# Altium schematic sheet SensorManagementSystem.SchDoc: Sensor Management System
size A4; DocumentNumber: 1; SheetNumber: 2; SheetTotal: 2
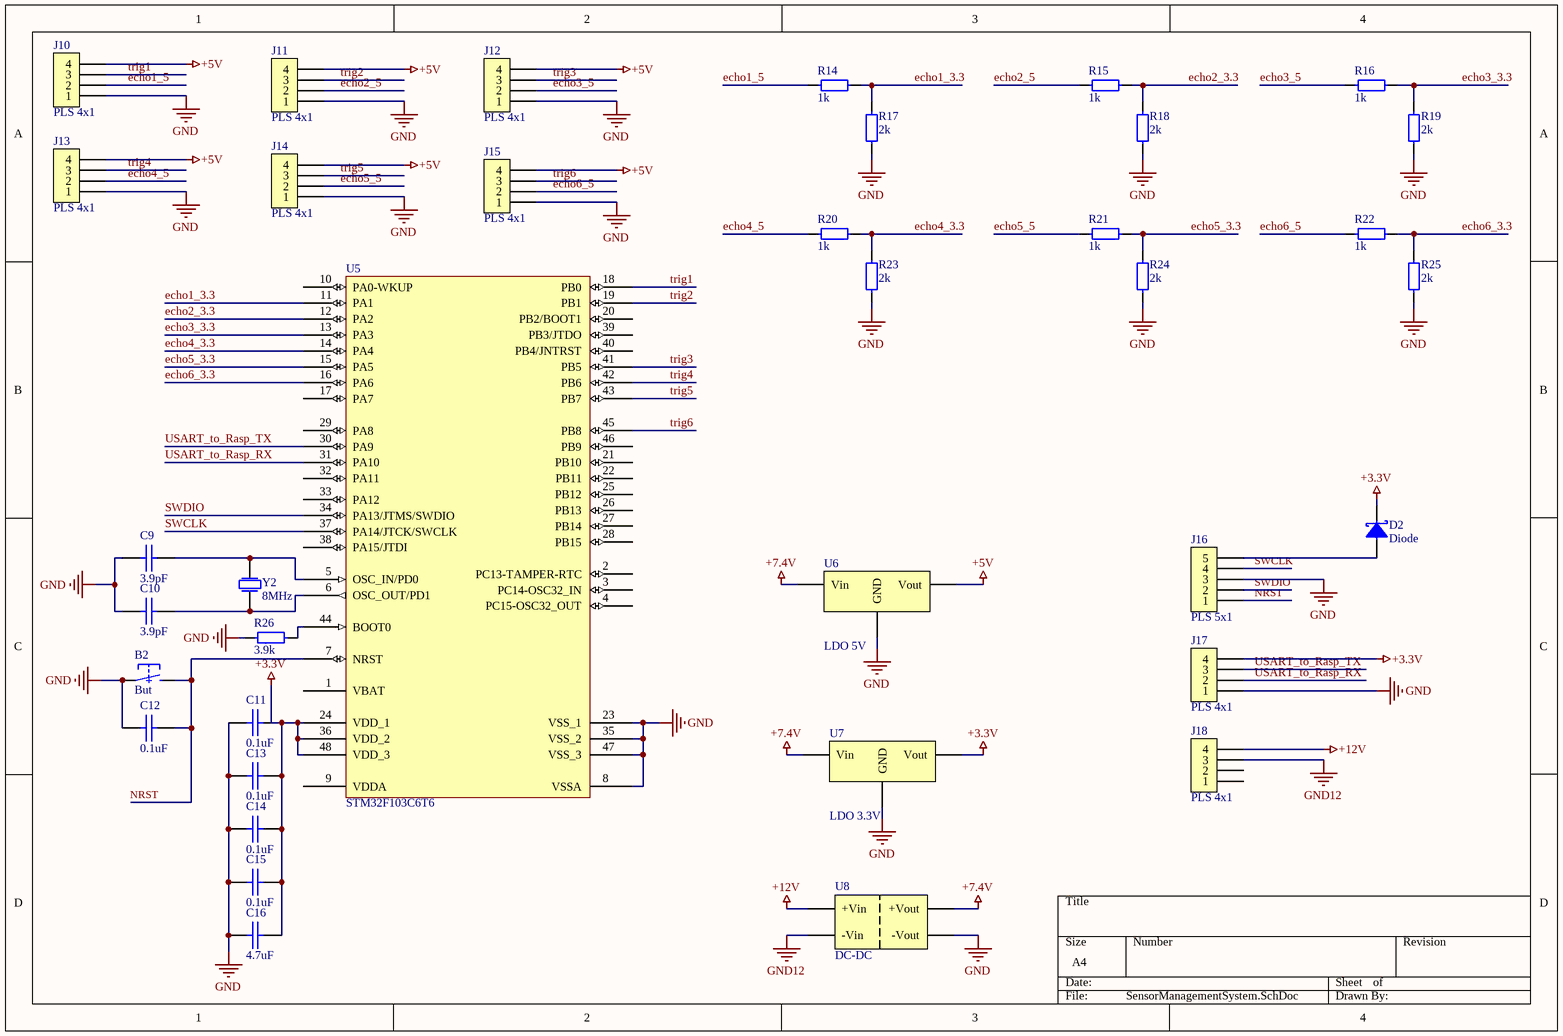
[diagram p0: SensorManagementSystem.SchDoc]

## Parts
B2  But  [BUTTON 6x3.5]
C9  3.9pF  [0805 Capicator]
C10  3.9pF  [0805 Capicator]
C11  0.1uF  [0805 Capicator]
C12  0.1uF  [0805 Capicator]
C13  0.1uF  [0805 Capicator]
C14  0.1uF  [0805 Capicator]
C15  0.1uF  [0805 Capicator]
C16  4.7uF  [0805 Capicator]
D2  Diode  [sod-123]
J10  PLS 4x1  [PLS 4x1]
J11  PLS 4x1  [PLS 4x1]
J12  PLS 4x1  [PLS 4x1]
J13  PLS 4x1  [PLS 4x1]
J14  PLS 4x1  [PLS 4x1]
J15  PLS 4x1  [PLS 4x1]
J16  PLS 5x1  [PLS 5x1]
J17  PLS 4x1  [PLS 4x1]
J18  PLS 4x1  [PLS 4x1]
R14  1k  [0805 Resistor]
R15  1k  [0805 Resistor]
R16  1k  [0805 Resistor]
R17  2k  [0805 Resistor]
R18  2k  [0805 Resistor]
R19  2k  [0805 Resistor]
R20  1k  [0805 Resistor]
R21  1k  [0805 Resistor]
R22  1k  [0805 Resistor]
R23  2k  [0805 Resistor]
R24  2k  [0805 Resistor]
R25  2k  [0805 Resistor]
R26  3.9k  [0805 Resistor]
U5  STM32F103C6T6  [STM32F103C6T6]
U6  LDO 5V  [TO-252]
U7  LDO 3.3V  [SOT-223]
U8  DC-DC  [DC-DC]
Y2  8MHz  [hc-49sm]

## Nets
+3.3V: C11.2 C13.2 C14.2 C15.2 C16.2 D2.2 J17.4 U5.24(VDD_1) U5.36(VDD_2) U5.48(VDD_3) U7.2(Vout)
+5V: J10.4 J11.4 J12.4 J13.4 J14.4 J15.4 U6.2(Vout)
+7.4V: U6.3(Vin) U7.3(Vin) U8.3(+Vout)
+12V: J18.4 U8.1(+Vin)
GND: B2.1 C9.1 C10.1 C11.1 C12.1 C13.1 C14.1 C15.1 C16.1 J10.1 J11.1 J12.1 J13.1 J14.1 J15.1 J16.3 J17.1 R17.1 R18.1 R19.1 R23.1 R24.1 R25.1 R26.1 U5.8(VSSA) U5.23(VSS_1) U5.35(VSS_2) U5.47(VSS_3) U6.1(GND) U7.1(GND) U8.4(-Vout)
GND12: J18.3 U8.2(-Vin)
echo1_3.3: R14.2 R17.2 U5.11(PA1)
echo1_5: J10.2 R14.1
echo2_3.3: R15.2 R18.2 U5.12(PA2)
echo2_5: J11.2 R15.1
echo3_3.3: R16.2 R19.2 U5.13(PA3)
echo3_5: J12.2 R16.1
echo4_3.3: R20.2 R23.2 U5.14(PA4)
echo4_5: J13.2 R20.1
echo5_3.3: R21.2 R24.2 U5.15(PA5)
echo5_5: J14.2 R21.1
echo6_3.3: R22.2 R25.2 U5.16(PA6)
echo6_5: J15.2 R22.1
NRST: B2.2 C12.2 J16.1 U5.7(NRST)
SWCLK: J16.4 U5.37(PA14/JTCK/SWCLK)
SWDIO: J16.2 U5.34(PA13/JTMS/SWDIO)
trig1: J10.3 U5.18(PB0)
trig2: J11.3 U5.19(PB1)
trig3: J12.3 U5.41(PB5)
trig4: J13.3 U5.42(PB6)
trig5: J14.3 U5.43(PB7)
trig6: J15.3 U5.45(PB8)
USART_to_Rasp_RX: J17.2 U5.31(PA10)
USART_to_Rasp_TX: J17.3 U5.30(PA9)
NetC9_2: C9.2 U5.5(OSC_IN/PD0) Y2.2
NetC10_2: C10.2 U5.6(OSC_OUT/PD1) Y2.1
NetD2_1: D2.1 J16.5
NetR26_2: R26.2 U5.44(BOOT0)

Not connected (* = marked no-connect by the designer): J18 1 2; U5 1(VBAT) 2(PC13-TAMPER-RTC) 3(PC14-OSC32_IN) 4(PC15-OSC32_OUT) 9(VDDA) 10(PA0-WKUP) 17(PA7) 20(PB2/BOOT1) 21(PB10) 22(PB11) 25(PB12) 26(PB13) 27(PB14) 28(PB15) 29(PA8) 32(PA11) 33(PA12) 38(PA15/JTDI) 39(PB3/JTDO) 40(PB4/JNTRST) 46(PB9)

## Library data of the parts
B2 = Button: Button 2 Conn SMD
C9 C10 = Cap 39pF
C11-C15 = Cap 0.1uF
C16 = Cap 4.7uF
D2 = Diode Schottky: 0.5 A, Low Forward Voltage less than 385 mV, 400 mW Power Dissipation Package
J10-J15 J17 J18 = Conn 4: Header, 4-Pin
J16 = Conn 5: Header, 5-Pin
R14-R16 R20-R22 = Res 1k
R17-R19 R23-R25 = Res 2k
R26 = Res 3.9k
U6 = LDO 5V: LDO Regulator Pos 5V 1A
U7 = LDO 3.3V: LDO Regulator Pos 3.3V 1.3A 4-Pin(3+Tab) SOT-223 T/R
Y2 = Crystal 8MHz: Crystal. HC-49SM (US)